# EAGLE schematic Overall Layout (EAGLE 9.6.1)

## Sheet 1 of 4
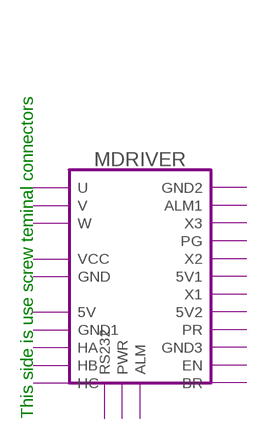
[diagram p0: schematic, sheet 1]

### Module instances
MDRIVER = MOTORDRIVER

### Notes on the sheet
- This side is use screw teminal connectors

## Sheet 2 of 4
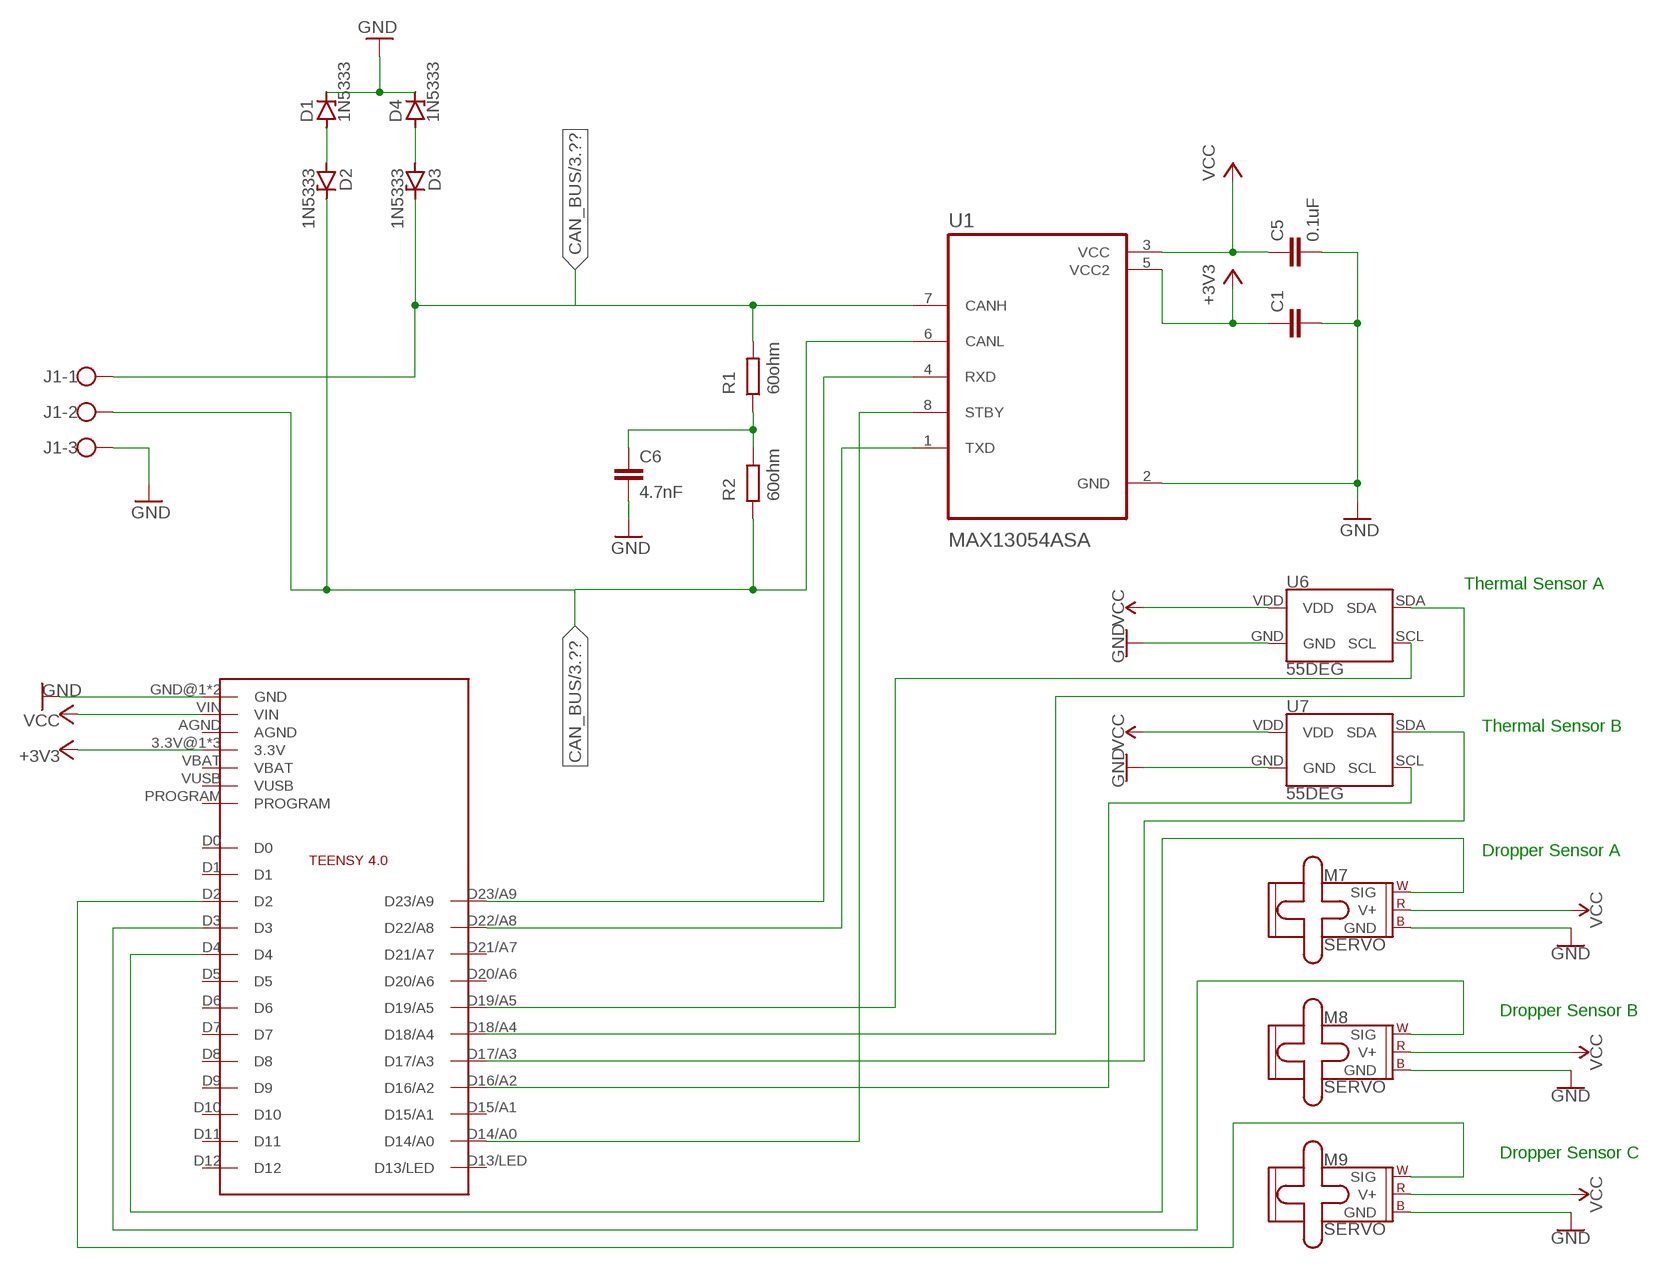
[diagram p1: schematic, sheet 2]

### Parts
C1  C2,5-3  [C2.5-3]
C5  0.1uF  C2,5-3  [C2.5-3]
C6  4.7nF  C2,5-3  [C2.5-3]
D1  1N5333  [C1702-15]
D2  1N5333  [C1702-15]
D3  1N5333  [C1702-15]
D4  1N5333  [C1702-15]
J1  W237-103  [W237-103]
M7  SERVO  [1X03]
M8  SERVO  [1X03]
M9  SERVO  [1X03]
R1  60ohm  R  (no package)
R2  60ohm  R  (no package)
U1  MAX13054ASA  [SOIC127P600X175-8N]
U6  55DEG  MLX90540_MLX90640  [MLX90540_MLX90640]
U7  55DEG  MLX90540_MLX90640  [MLX90540_MLX90640]
U$2  TEENSY4.0  [TEENSY4.0]

### Nets
+3V3: C1.1 U1.5(VCC2) U$2.3.3V@1(3.3V) U$2.3.3V@2(3.3V) U$2.ON/OFF(3.3V) ; also sheet 3,4
CAN_BUS: D3.C J1.1 R1.2 U1.7(CANH) ; also sheet 3,4
GND: C1.2 C5.2 C6.2 D1.C D4.C J1.3 M7.3(GND) M8.3(GND) M9.3(GND) U1.2(GND) U6.GND U7.GND U$2.GND@1(GND) U$2.GND@2(GND) ; also sheet 3,4
N$1: U1.4(RXD) U$2.D23/A9
N$2: U1.1(TXD) U$2.D22/A8
N$4: D1.A D2.A
N$5: D2.C J1.2 R2.1 U1.6(CANL)
N$6: C6.1 R1.1 R2.2
N$7: D3.A D4.A
N$46: U1.8(STBY) U$2.D14/A0
N$48: U7.SDA U$2.D17/A3
N$49: U7.SCL U$2.D16/A2
N$50: M7.1(SIG) U$2.D4
N$51: M8.1(SIG) U$2.D3
N$52: M9.1(SIG) U$2.D2
N$53: U6.SCL U$2.D19/A5
N$55: U6.SDA U$2.D18/A4
VCC: C5.1 M7.2(V+) M8.2(V+) M9.2(V+) U1.3(VCC) U6.VDD U7.VDD U$2.VIN ; also sheet 3,4
Unconnected: U$2.AGND U$2.D0 U$2.D1 U$2.D5 U$2.D6 U$2.D7 U$2.D8 U$2.D9 U$2.D10 U$2.D11 U$2.D12 U$2.D13/LED U$2.D15/A1 U$2.D20/A6 U$2.D21/A7 U$2.PROGRAM U$2.VBAT U$2.VUSB

### Notes on the sheet
- Thermal Sensor A
- Thermal Sensor B
- Dropper Sensor A
- Dropper Sensor B
- Dropper Sensor C

## Sheet 3 of 4
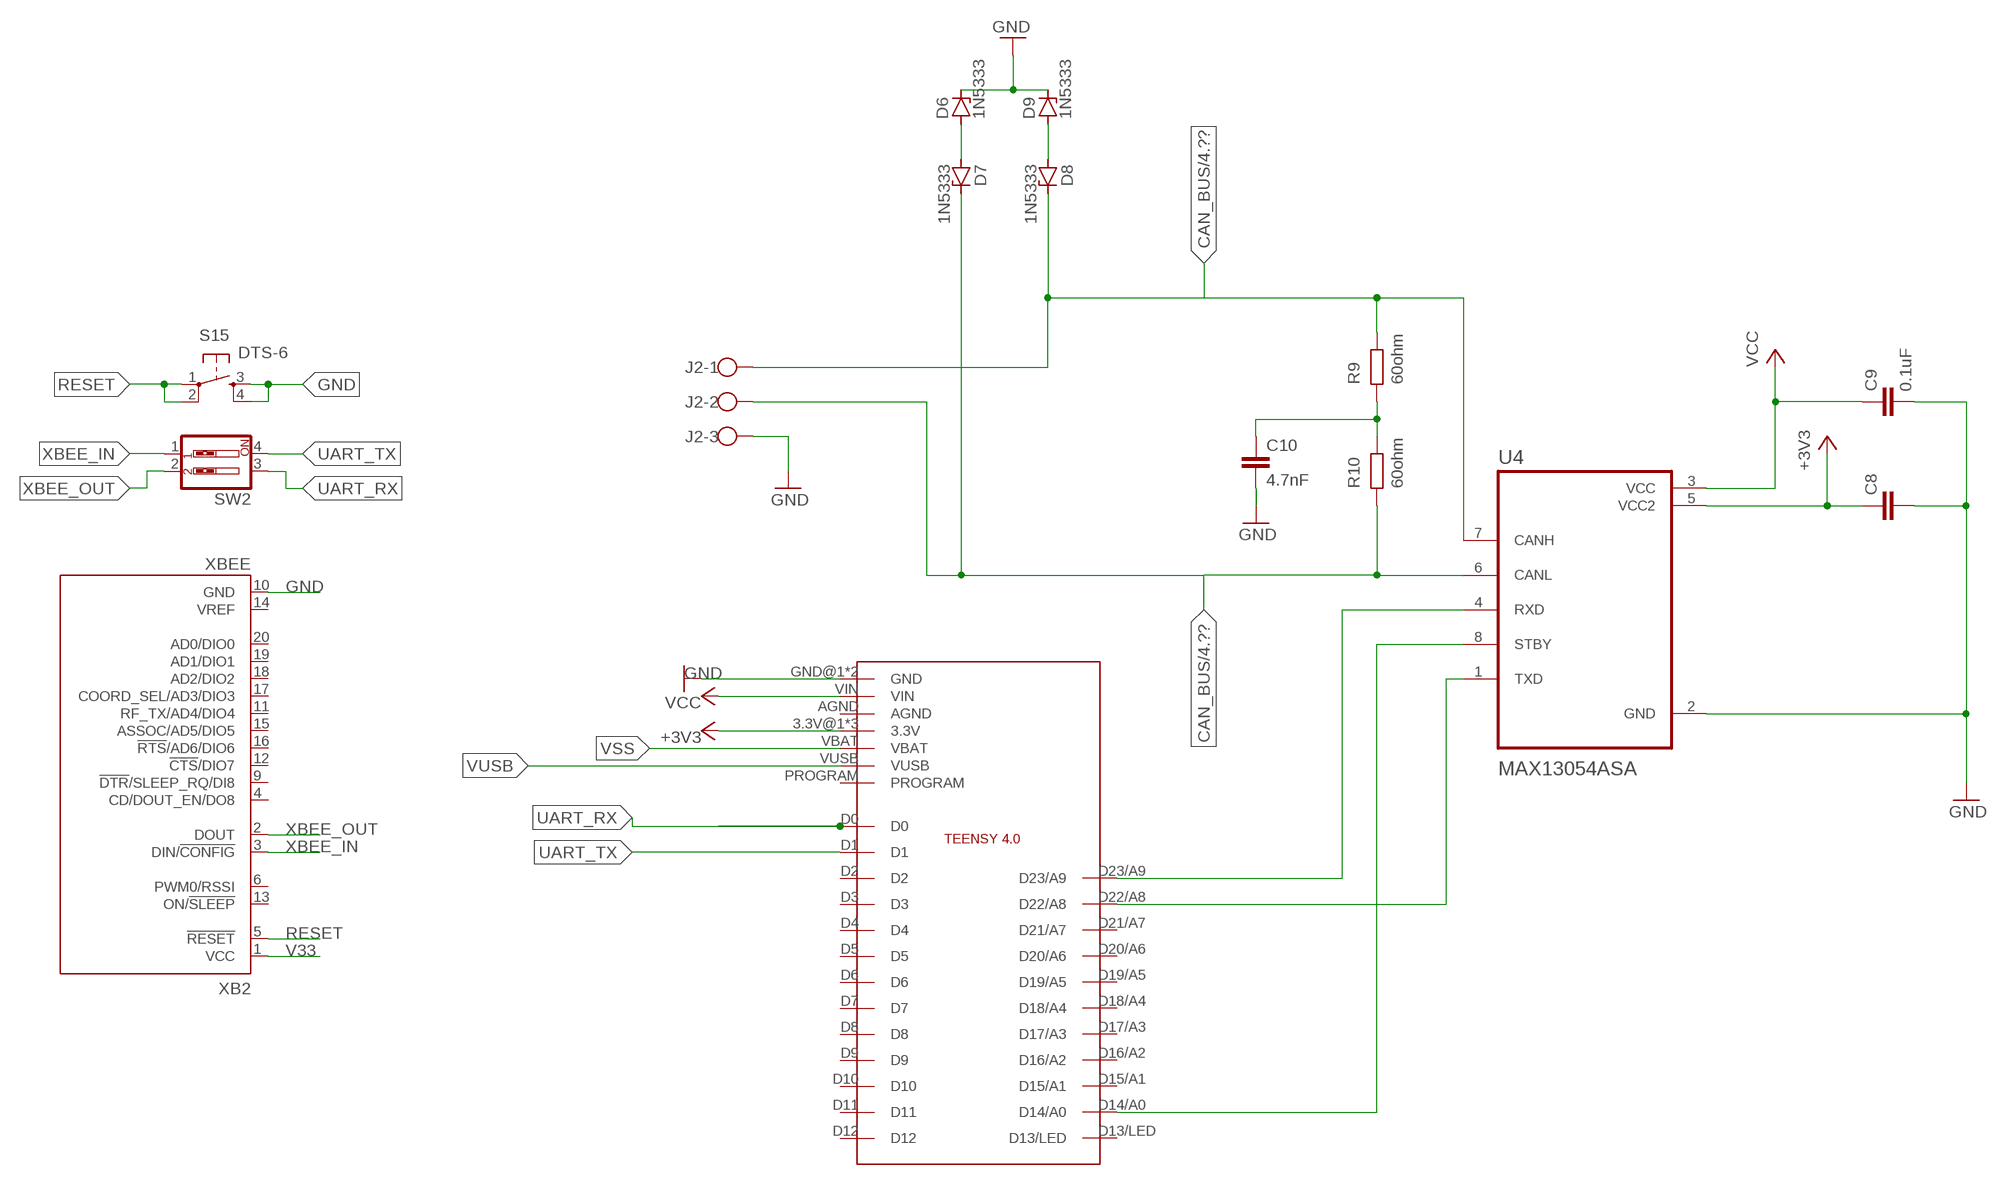
[diagram p2: schematic, sheet 3]

### Parts
C8  C2,5-3  [C2.5-3]
C9  0.1uF  C2,5-3  [C2.5-3]
C10  4.7nF  C2,5-3  [C2.5-3]
D6  1N5333  [C1702-15]
D7  1N5333  [C1702-15]
D8  1N5333  [C1702-15]
D9  1N5333  [C1702-15]
J2  W237-103  [W237-103]
R9  60ohm  R  (no package)
R10  60ohm  R  (no package)
S15  DTS-6  [DTS-6]
SW2  SW_DIP-2  [EDG-02]
U4  MAX13054ASA  [SOIC127P600X175-8N]
U$6  TEENSY4.0  [TEENSY4.0]
XB2  XBEE  [XBEE]

### Nets
+3V3: C8.1 U4.5(VCC2) U$6.3.3V@1(3.3V) U$6.3.3V@2(3.3V) U$6.ON/OFF(3.3V) ; also sheet 2,4
CAN_BUS: D8.C J2.1 R9.2 U4.7(CANH) ; also sheet 2,4
GND: C8.2 C9.2 C10.2 D6.C D9.C J2.3 S15.3 S15.4 U4.2(GND) U$6.GND@1(GND) U$6.GND@2(GND) XB2.10(GND) ; also sheet 2,4
N$3: D7.C J2.2 R10.1 U4.6(CANL)
N$40: U4.8(STBY) U$6.D14/A0
N$41: U4.4(RXD) U$6.D23/A9
N$42: U4.1(TXD) U$6.D22/A8
N$43: C10.1 R9.1 R10.2
N$44: D6.A D7.A
N$45: D8.A D9.A
RESET: S15.1 S15.2 XB2.5(!RESET)
UART_RX: SW2.3 U$6.D0
UART_TX: SW2.4 U$6.D1
V33: XB2.1(VCC)
VCC: C9.1 U4.3(VCC) U$6.VIN ; also sheet 2,4
VSS: U$6.VBAT
VUSB: U$6.VUSB
XBEE_IN: SW2.1 XB2.3(DIN/!CONFIG)
XBEE_OUT: SW2.2 XB2.2(DOUT)
Unconnected: U$6.AGND U$6.D2 U$6.D3 U$6.D4 U$6.D5 U$6.D6 U$6.D7 U$6.D8 U$6.D9 U$6.D10 U$6.D11 U$6.D12 U$6.D13/LED U$6.D15/A1 U$6.D16/A2 U$6.D17/A3 U$6.D18/A4 U$6.D19/A5 U$6.D20/A6 U$6.D21/A7 U$6.PROGRAM XB2.4(CD/DOUT_EN/DO8) XB2.6(PWM0/RSSI) XB2.9(!DTR!/SLEEP_RQ/DI8) XB2.11(RF_TX/AD4/DIO4) XB2.12(!CTS!/DIO7) XB2.13(ON/!SLEEP) XB2.14(VREF) XB2.15(ASSOC/AD5/DIO5) XB2.16(!RTS!/AD6/DIO6) XB2.17(COORD_SEL/AD3/DIO3) XB2.18(AD2/DIO2) XB2.19(AD1/DIO1) XB2.20(AD0/DIO0)

## Sheet 4 of 4
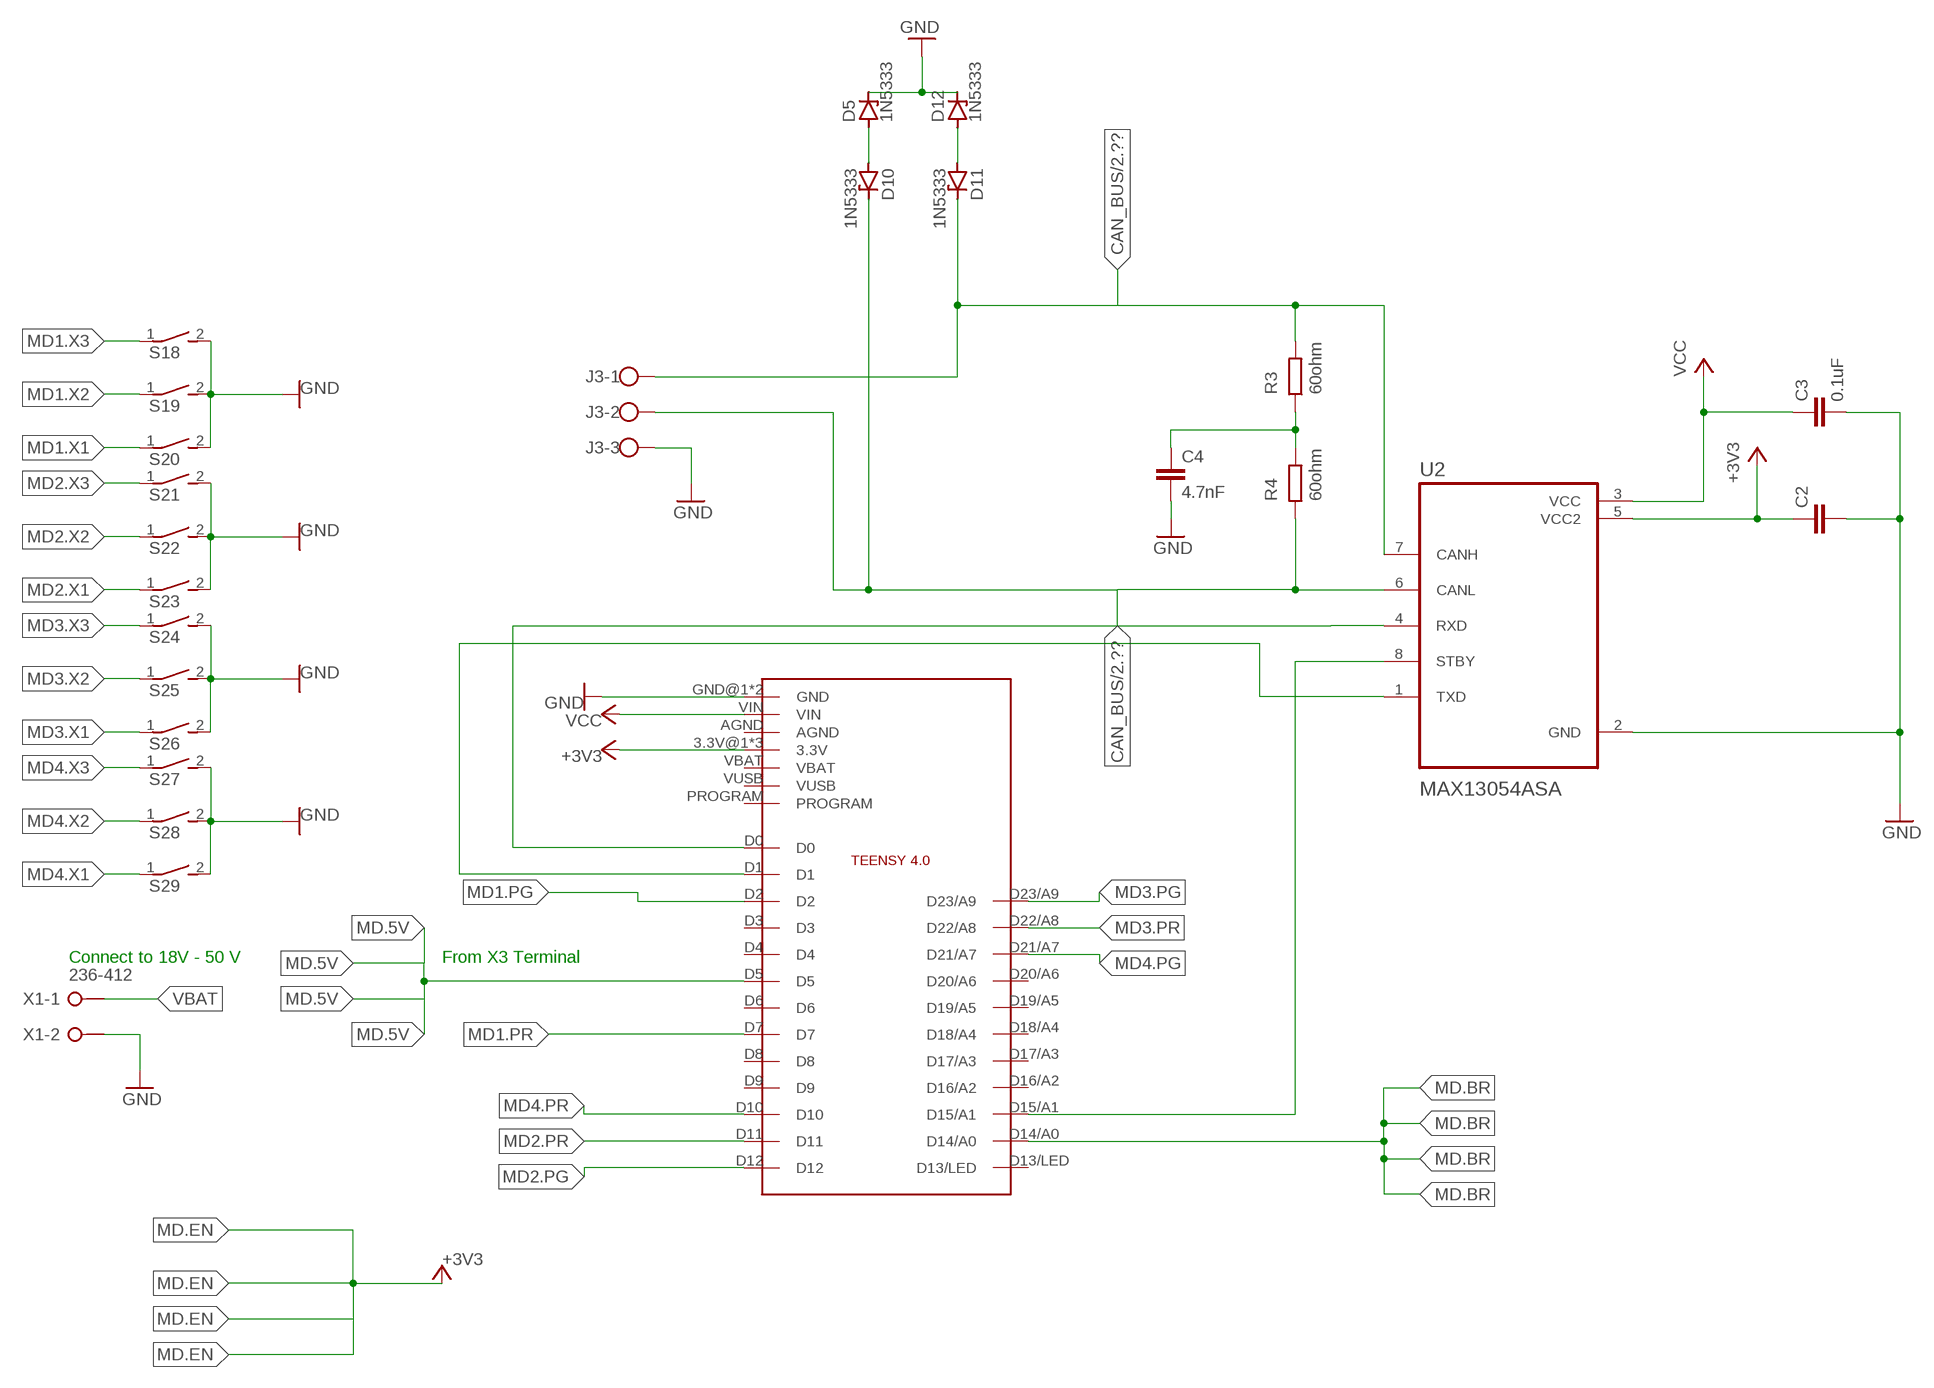
[diagram p3: schematic, sheet 4]

### Parts
C2  C2,5-3  [C2.5-3]
C3  0.1uF  C2,5-3  [C2.5-3]
C4  4.7nF  C2,5-3  [C2.5-3]
D5  1N5333  [C1702-15]
D10  1N5333  [C1702-15]
D11  1N5333  [C1702-15]
D12  1N5333  [C1702-15]
J3  W237-103  [W237-103]
R3  60ohm  R  (no package)
R4  60ohm  R  (no package)
S18  DS01E  [DS-01]
S19  DS01E  [DS-01]
S20  DS01E  [DS-01]
S21  DS01E  [DS-01]
S22  DS01E  [DS-01]
S23  DS01E  [DS-01]
S24  DS01E  [DS-01]
S25  DS01E  [DS-01]
S26  DS01E  [DS-01]
S27  DS01E  [DS-01]
S28  DS01E  [DS-01]
S29  DS01E  [DS-01]
U2  MAX13054ASA  [SOIC127P600X175-8N]
U$3  TEENSY4.0  [TEENSY4.0]
X1  236-412  [236-412]

### Nets
+3V3: C2.1 U2.5(VCC2) U$3.3.3V@1(3.3V) U$3.3.3V@2(3.3V) U$3.ON/OFF(3.3V) ; also sheet 2,3
CAN_BUS: D11.C J3.1 R3.2 U2.7(CANH) ; also sheet 2,3
GND: C2.2 C3.2 C4.2 D5.C D12.C J3.3 S18.2 S19.2 S20.2 S21.2 S22.2 S23.2 S24.2 S25.2 S26.2 S27.2 S28.2 S29.2 U2.2(GND) U$3.GND@1(GND) U$3.GND@2(GND) X1.2@1(-2:KL1) ; also sheet 2,3
MD1.PG: U$3.D2
MD1.PR: U$3.D7
MD1.X1: S20.1
MD1.X2: S19.1
MD1.X3: S18.1
MD2.PG: U$3.D12
MD2.PR: U$3.D11
MD2.X1: S23.1
MD2.X2: S22.1
MD2.X3: S21.1
MD3.PG: U$3.D23/A9
MD3.PR: U$3.D22/A8
MD3.X1: S26.1
MD3.X2: S25.1
MD3.X3: S24.1
MD4.PG: U$3.D21/A7
MD4.PR: U$3.D10
MD4.X1: S29.1
MD4.X2: S28.1
MD4.X3: S27.1
MD.5V: U$3.D5
MD.BR: U$3.D14/A0
N$9: D10.C J3.2 R4.1 U2.6(CANL)
N$10: U2.8(STBY) U$3.D15/A1
N$11: U2.4(RXD) U$3.D0
N$12: U2.1(TXD) U$3.D1
N$13: C4.1 R3.1 R4.2
N$14: D5.A D10.A
N$15: D11.A D12.A
VBAT: X1.1@1(-1:KL1)
VCC: C3.1 U2.3(VCC) U$3.VIN ; also sheet 2,3
Unconnected: U$3.AGND U$3.D3 U$3.D4 U$3.D6 U$3.D8 U$3.D9 U$3.D13/LED U$3.D16/A2 U$3.D17/A3 U$3.D18/A4 U$3.D19/A5 U$3.D20/A6 U$3.PROGRAM U$3.VBAT U$3.VUSB X1.1@2(-1:KL2) X1.2@2(-2:KL2) X1.3@1(-3:KL1) X1.3@2(-3:KL2) X1.4@1(-4:KL1) X1.4@2(-4:KL2) X1.5@1(-5:KL1) X1.5@2(-5:KL2) X1.6@1(-6:KL1) X1.6@2(-6:KL2) X1.7@1(-7:KL1) X1.7@2(-7:KL2) X1.8@1(-8:KL1) X1.8@2(-8:KL2) X1.9@1(-9:KL1) X1.9@2(-9:KL2) X1.10@1(-10:KL1) X1.10@2(-10:KL2) X1.11@1(-11:KL1) X1.11@2(-11:KL2) X1.12@1(-12:KL1) X1.12@2(-12:KL2)

### Notes on the sheet
- Connect to 18V - 50 V | From X3 Terminal

## Library data of the parts
C1-C6 C8-C10 = capacitor-wima:C: CAPACITOR naming: grid - package width
D1-D12 = diode:1N5333: Z DIODE 3.3 V, 5W, 5 percent (Motorola)
J1-J3 = con-wago-500:W237-103: WAGO SCREW CLAMP; MPN: 237-103; OC_FARNELL: unknown; OC_NEWARK: 18M7116
M7-M9 = SparkFun-Electromechanical:SERVO: Servo Motor 3-pin connector for a standard servo motor (voltage supply, ground, and control signal.) SparkFun Products Servo - Generic (Sub-Micro Size) <https://www.sparkfun.com/products/9065> (ROB-09065) Servo - Generic High Torque Continuous Rotation (Standard Size) <https://www.sparkfun.com/products/9347> (ROB-09347) Servo - Generic High Torque (Standard Size) <https://www.sparkfun.com/products/11965> (ROB-11965)
R1-R4 R9 R10 = ngspice-simulation:R: RESISTOR
S15 = switch-tact:DTS-6
S18-S29 = switch-dil:DS01E: DIL/CODE SWITCH; OC_FARNELL: unknown; OC_NEWARK: unknown
SW2 = special:SW_DIP-2: DIP SWITCH
U1 U2 U4 = MAX13054ASA:MAX13054ASA; DESCRIPTION: 1/1 Transceiver Full CANbus 8-SOIC; DIGI-KEY_PART_NUMBER: MAX13054ASA+TTR-ND; DIGI-KEY_PURCHASE_URL: https://www.digikey.com/product-detail/en/maxim-integrated/MAX13054ASA-T/MAX13054ASA-TTR-ND/1475460?utm_source=snapeda&utm_medium=aggregator&utm_campaign=symbol; MF: Maxim Integrated; MP: MAX13054ASA+; PACKAGE: SOIC-8 Maxim
U6 U7 = SparkFun-IC-Special-Function:MLX90540_MLX90640: Melexis MLX90640 Infrared Array The MLX90640 is a fully calibrated 32x24 pixels thermal IR array in an industry standard 4-lead TO39 package with digital interface.; PROD_ID: IC-14042
U$2 U$3 U$6 = Teensy4.0:TEENSY4.0
X1 = con-wago-508:236-412: Terminal Strips 2.5 mm2/AWG 12, Series 236, Pin Spacings 5/5.08 mm Source: Data sheet <http://www.farnell.com/datasheets/63479.pdf>; MF: Wago Corporation; MPN: 0236-0412; OC_FARNELL: 1283531; OC_NEWARK: 79K2064
XB2 = maxstream:XBEE: XBee (TM) /XBee-PRO(TM) OEM RF Modules Source: MaxStream, Inc. xbee_productmanual.pdf; MPN: XBP24-Z7UIT-004; OC_FARNELL: 1751799; OC_NEWARK: 34R5507

## Module RESISTER
Ports: 

### Library data of the parts

## Module GND
Ports: 

### Library data of the parts

## Module MOTOR
Ports: 

### Library data of the parts

## Module MOTORDRIVER
Ports: U(io) V(io) W(io) VCC(io) GND(io) 5V(io) GND1(io) HA(io) HB(io) HC(io) RS232(io) PWR(io) ALM(io) GND2(io) ALM1(io) X3(io) PG(io) X2(io) 5V1(io) X1(io) 5V2(io) PR(io) GND3(io) EN(io) BR(io)

### Library data of the parts